# EAGLE design lis331hh (EAGLE 7.3.0)
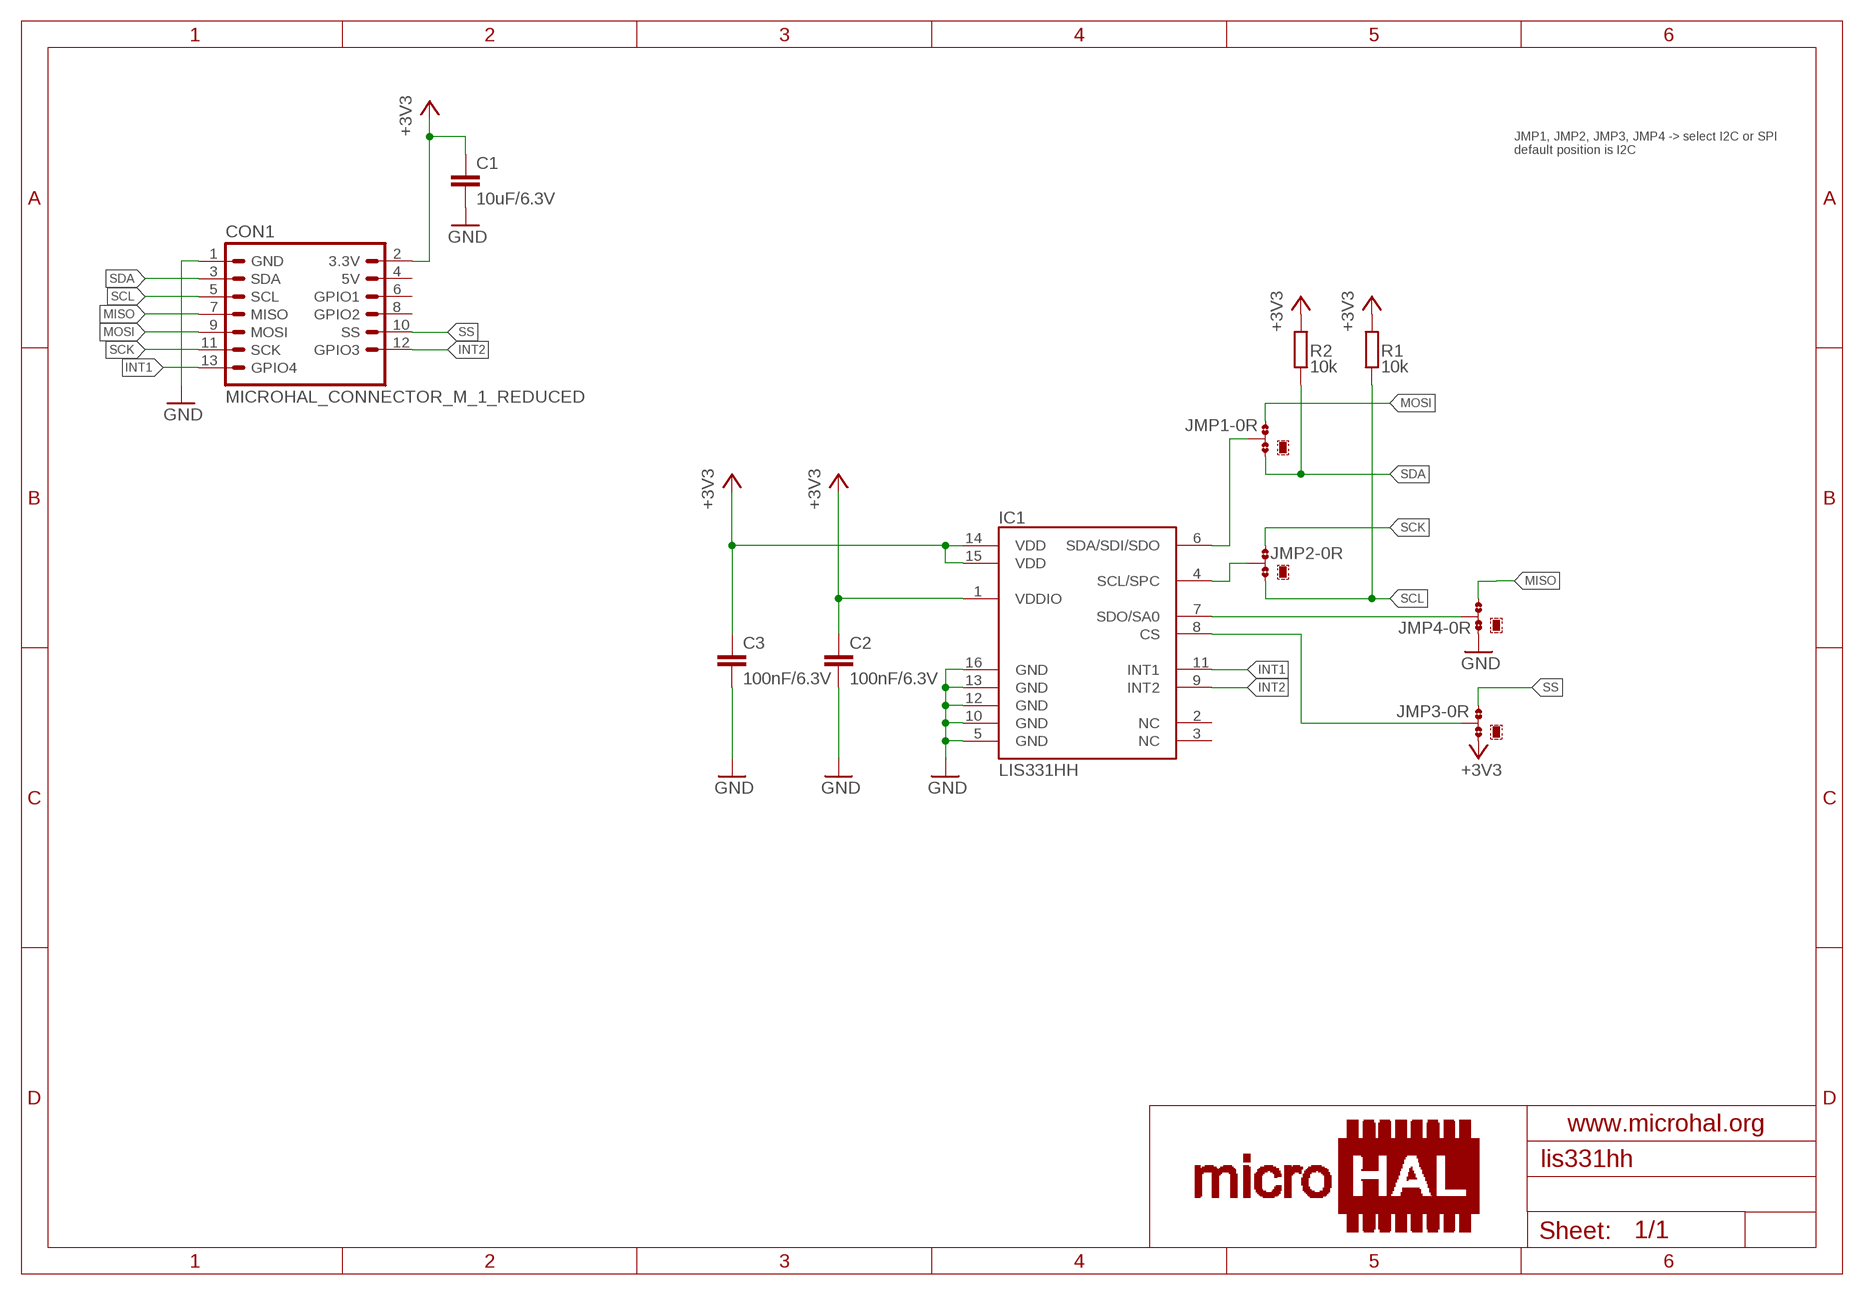
[diagram p0: schematic, sheet 1]

## Parts
C1  10uF/6.3V  C-EUC0805K  [C0805K]
C2  100nF/6.3V  C-EUC0603K  [C0603K]
C3  100nF/6.3V  C-EUC0603K  [C0603K]
CON1  MICROHAL_CONNECTOR_M_1_REDUCED  [MICROHAL_CONNECTOR_M_1_REDUCED_EDGE]
IC1  LIS331HH  [LGA16]
JMP1  0R-JUMPC  [C0R-JMP]
JMP2  0R-JUMPC  [C0R-JMP]
JMP3  0R-JUMPC  [C0R-JMP]
JMP4  0R-JUMPC  [C0R-JMP]
R1  10k  R-EU_R0603  [R0603]
R2  10k  R-EU_R0603  [R0603]

## Nets
+3V3: C1.1 C2.1 C3.1 CON1.2(3.3V) IC1.1(VDDIO) IC1.14(VDD) IC1.15(VDD) JMP3.1 R1.2 R2.2
GND: C1.2 C2.2 C3.2 CON1.1(GND) IC1.5(GND) IC1.10(GND) IC1.12(GND) IC1.13(GND) IC1.16(GND) JMP4.1
INT1: CON1.13(GPIO4) IC1.11(INT1)
INT2: CON1.12(GPIO3) IC1.9(INT2)
MISO: CON1.7(MISO) JMP4.3
MOSI: CON1.9(MOSI) JMP1.3
N$1: IC1.8(CS) JMP3.2
N$2: IC1.7(SDO/SA0) JMP4.2
N$4: IC1.6(SDA/SDI/SDO) JMP1.2
N$5: IC1.4(SCL/SPC) JMP2.2
SCK: CON1.11(SCK) JMP2.3
SCL: CON1.5(SCL) JMP2.1 R1.1
SDA: CON1.3(SDA) JMP1.1 R2.1
SS: CON1.10(SS) JMP3.3
Unconnected: CON1.4(5V) CON1.6(GPIO1) CON1.8(GPIO2) IC1.2(NC) IC1.3(NC)

## Notes on the sheet
- JMP1, JMP2, JMP3, JMP4 -> select I2C or SPI
  default position is I2C

## Library data of the parts
C1-C3 = rcl:C-EU: CAPACITOR, European symbol
CON1 = microhal-connector_v0.1:MICROHAL_CONNECTOR_M_1_REDUCED
IC1 = lis331hh:LIS331HH
JMP1-JMP4 = jump-0r-smd:0R-JUMP: SMD 0R 0805 Jumper
R1 R2 = rcl:R-EU_: RESISTOR, European symbol

## Board
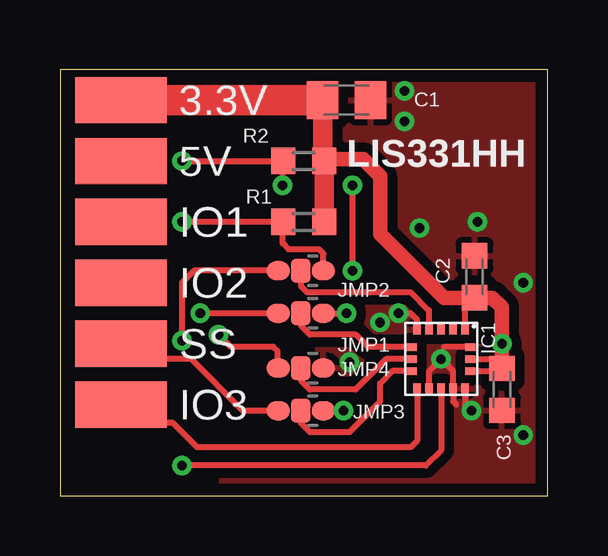
[diagram p1: board, top side]
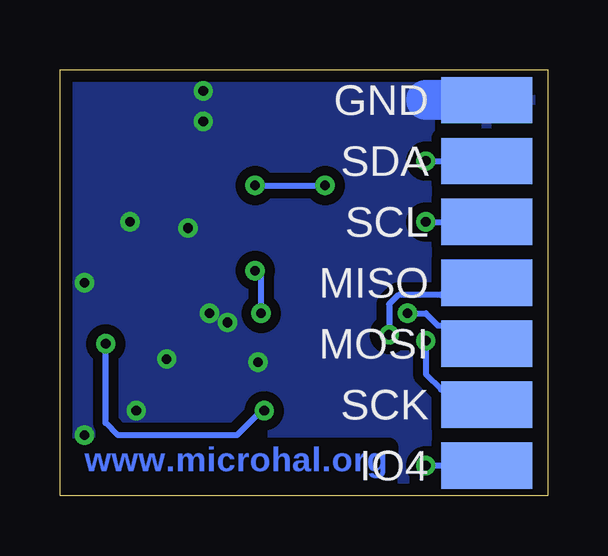
[diagram p2: board, bottom side, seen from below]

Size 20.32 x 17.78 mm. Coordinates in mm from the lower left corner, seen from the top.
Outline: 0,0 20.32,0 20.32,17.78 0,17.78 0,0
Copper layers (1*16): Top 0.035mm / dielectric 1.5mm / Bottom 0.035mm
Design rules "default *": minimum track width 10mil, minimum drill 14mil, track to track 8mil, track to pad 8mil, pad to pad 8mil, via to via 8mil, smd to smd 4mil, copper to edge 20mil, drill to drill 8mil, minimum pad ring 10mil, minimum via ring 8mil, stop-mask expansion 4mil, vias tented up to drill 16mil, thermal gap 10mil

### Footprints (pad centres in the part's own frame; a part is rotated, then mirrored left to right if it is on the bottom)
C0805K = smd 1.3 x 1.6: 1 -1,0; 2 1,0
C0603K = smd 1.05 x 1.08: 1 -0.875,0; 2 0.875,0
MICROHAL_CONNECTOR_M_1_REDUCED_EDGE = smd 1.93 x 3.81 bottom: 1 -7.62,0; 3 -5.08,0; 5 -2.54,0; 7 0,0; 9 2.54,0; 11 5.08,0; 13 7.62,0 | smd 1.93 x 3.81: 2 -7.62,0; 4 -5.08,0; 6 -2.54,0; 8 0,0; 10 2.54,0; 12 5.08,0
LGA16 = smd 0.41 x 0.31: 1 -1.225,1; 2 -1.225,0.5; 3 -1.225,0; 4 -1.225,-0.5; 5 -1.225,-1; 9 1.225,-1; 10 1.225,-0.5; 11 1.225,0; 12 1.225,0.5; 13 1.225,1 | smd 0.31 x 0.41: 6 -0.5,-1.225; 7 0,-1.225; 8 0.5,-1.225; 14 0.5,1.225; 15 0,1.225; 16 -0.5,1.225
C0R-JMP = smd 0.8 x 1: 1 0,0.938; 3 0,-0.938 | smd 1 x 0.8: 2 0,0
R0603 = smd 1 x 1.1: 1 -0.85,0; 2 0.85,0

### Placement (x,y rotation side)
C1  11.94,16.51 0 top
C2  17.27,9.14 90 top
C3  18.41,4.45 270 top
CON1  2.54,8.89 270 top
IC1  15.88,5.71 270 top
JMP1  10.03,7.62 270 top
JMP2  10.03,9.4 270 top
JMP3  10.03,3.56 270 top
JMP4  10.03,5.33 270 top
R1  10.16,11.43 0 top
R2  10.16,13.97 0 top

### Tracks (layer width: path | path; a pad name or v marks a point on that pad's centre or on a via)
+3V3  (via drill 0.4)
  Top 0.254: IC1.14 18.31,5.21 C3.1 18.02,5.71 IC1.15 | IC1.1 16.88,7.87 C2.1 | JMP3.1 v11.81,3.56
  Top 0.61: C3.1 v18.41,6.35 18.41,7.87 18.02,8.27 C2.1 17.26,8.26 16,8.26 13.34,10.92 13.34,13.34 12.63,14.04 10.94,14.04
  Top 0.813: C1.1 10.94,14.04 R2.2 R1.2
  Top 1.27: CON1.2 C1.1
  Bottom 0.254: v11.81,3.56 11.94,3.56 12.95,2.54 17.91,2.54 18.41,3.05 v18.41,6.35
GND  (via drill 0.4)
  Top 0.254: 16.51,3.81 16.38,3.94 IC1.12 16.38,5.21 v15.88,5.71 15.38,5.21 IC1.10 | IC1.13 16.88,3.83 16.89,3.81 | IC1.16 16.01,6.21 16,6.22 | IC1.5 14.88,7.35 14.61,7.62 v14.1,7.62
  Bottom 1.676: CON1.1 5.08,16.51
  other vias: 14.35,16.89 17.14,3.56 13.34,7.24 14.35,15.62 17.4,11.43 19.3,8.89 14.99,11.18 19.3,2.54 12.06,5.59
  pour Bottom (isolate 0.406): 0,17.78 20.32,17.78 20.32,0 0,0
  pour Top (isolate 0.406): 6.73,17.78 20.32,17.78 20.32,0 6.73,0
INT1  (via drill 0.4)
  Top 0.254: IC1.11 15.88,1.91 15.24,1.27 v5.08,1.27
  Bottom 0.254: v5.08,1.27 CON1.13
INT2
  Top 0.254: IC1.9 14.88,2.3 14.61,2.03 5.71,2.03 4.7,3.05 3.3,3.05 CON1.12
MISO  (via drill 0.4)
  Top 0.254: v6.6,6.73 7.11,6.22 8.89,6.22 9.07,6.05 9.07,5.33 JMP4.3
  Bottom 0.254: CON1.7 3.94,8.89 4.45,8.38 6.22,8.38 6.6,8 v6.6,6.73
MOSI  (via drill 0.4)
  Top 0.254: JMP1.3 v5.84,7.62
  Bottom 0.254: v5.84,7.62 5.08,7.62 4.57,7.11 3.3,7.11 CON1.9
N$1
  Top 0.254: IC1.8 13.84,5.21 13.34,4.71 13.34,3.94 12.06,2.67 10.41,2.67 10.03,3.05 JMP3.2
N$2
  Top 0.254: IC1.7 13.59,5.71 12.32,4.45 10.41,4.45 10.03,4.83 JMP4.2
N$4
  Top 0.254: IC1.6 12.84,6.21 12.32,6.73 10.41,6.73 10.03,7.11 JMP1.2
N$5
  Top 0.254: JMP2.2 10.03,8.76 10.29,8.51 14.61,8.51 15.37,7.75 15.37,6.95 IC1.4
SCK  (via drill 0.4)
  Top 0.254: JMP2.3 5.59,9.4 5.08,8.89 v5.08,6.48
  Bottom 0.254: v5.08,6.48 5.08,5.08 4.45,4.45 3.17,4.45 CON1.11
SCL  (via drill 0.4)
  Top 0.254: JMP2.1 10.97,10.11 10.79,10.29 9.53,10.29 9.27,10.54 9.27,11.39 R1.1 v5.08,11.43
  Bottom 0.254: v5.08,11.43 CON1.5
SDA  (via drill 0.4)
  Top 0.254: JMP1.1 v11.94,7.62 | v12.19,9.4 v12.19,12.95 | v5.08,13.97 R2.1 9.27,13.93 v9.27,12.95
  Bottom 0.254: v5.08,13.97 CON1.3 | v11.94,7.62 11.94,9.14 v12.19,9.4 | v12.19,12.95 v9.27,12.95
SS
  Top 0.254: JMP3.3 7.62,3.56 5.46,5.71 3.17,5.71
  Top 0.406: 3.17,5.71 CON1.10

### Text on the board
Bottom: www.microhal.org
tPlace: LIS331HH
bStop: www.microhal.org